# Altium schematic sheet ReflectanceDigitalTotal.SchDoc
size A4; SheetNumber: 1; SheetTotal: 2
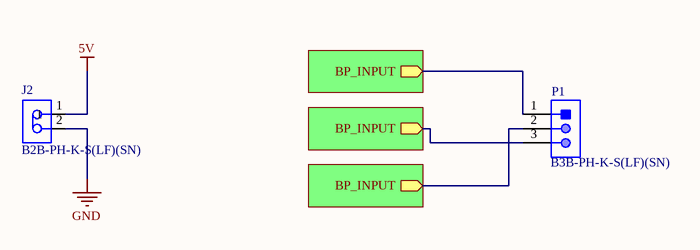
[diagram p0: ReflectanceDigitalTotal.SchDoc]

## Parts
J2  B2B-PH-K-S(LF)(SN)  [JST-B2B-PH-K-S_V]
P1  B3B-PH-K-S(LF)(SN)  [JST-B3B-PH-K-S-3_V]

## Sub-sheets
U_ReflectanceSensor = ReflectanceSensor.SchDoc: BP_INPUT (out)
U_ReflectanceSensor = ReflectanceSensor.SchDoc: BP_INPUT (out)
U_ReflectanceSensor = ReflectanceSensor.SchDoc: BP_INPUT (out)

## Nets
5V: J2.1
GND: J2.2
NetP1_1: P1.1 ; sheet U_ReflectanceSensor/BP_INPUT
NetP1_2: P1.2 ; sheet U_ReflectanceSensor/BP_INPUT
NetP1_3: P1.3 ; sheet U_ReflectanceSensor/BP_INPUT

## Library data of the parts
J2 = CMP-2000-05162-1: Male Header, Pitch 2 mm, 1 x 2 Position, Height 6 mm, Tail Length 3.4 mm, -25 to 85 degC, RoHS, Bulk; Manufacturer: JST; Pitch: 2mm; Style/Orientation: StraightHeader/Plug; No of Positions: 2; Datasheet Version: Nov-08; Datasheet URL: http://datasheet.octopart.com/B2B-PH-K-S%28LF%29%28SN%29-JST-datasheet-8324864.pdf; Manufacturer URL: http://www.jst.com/home2.html; Type: ShroudedHeader; Termination: Crimp
P1 = CMP-2000-05164-1: Male Header, Pitch 2 mm, 1 x 3 Position, Height 6 mm, Tail Length 3.4 mm, -25 to 85 degC, RoHS, Bulk; Manufacturer: JST; Style/Orientation: StraightHeader/Plug; Pitch: 2mm; No of Positions: 3; Termination: Crimp; Manufacturer URL: http://www.jst.com/home2.html; Datasheet Version: Oct-06; Type: ShroudedHeader; Datasheet URL: https://datasheet.ciiva.com/11746/0900766b80826550-11746939.pdf